# EasyEDA Pro project ProProject_AGV_VH723_MAIN_BOARD_2024-06-24.epro

# Schematic Schematic1
Create Date: 2024-06-01; Page Name: P1; Project Name: AGV_VH723_MAIN_BOARD; Schematic Name: Schematic1; Update Date: 2024-06-02; Company: EasyEDA.com; Drawn: EasyEDA; Page Size: A4; Part Number: JLCPCB-002; Reviewed: EasyEDA; Version: V0.1
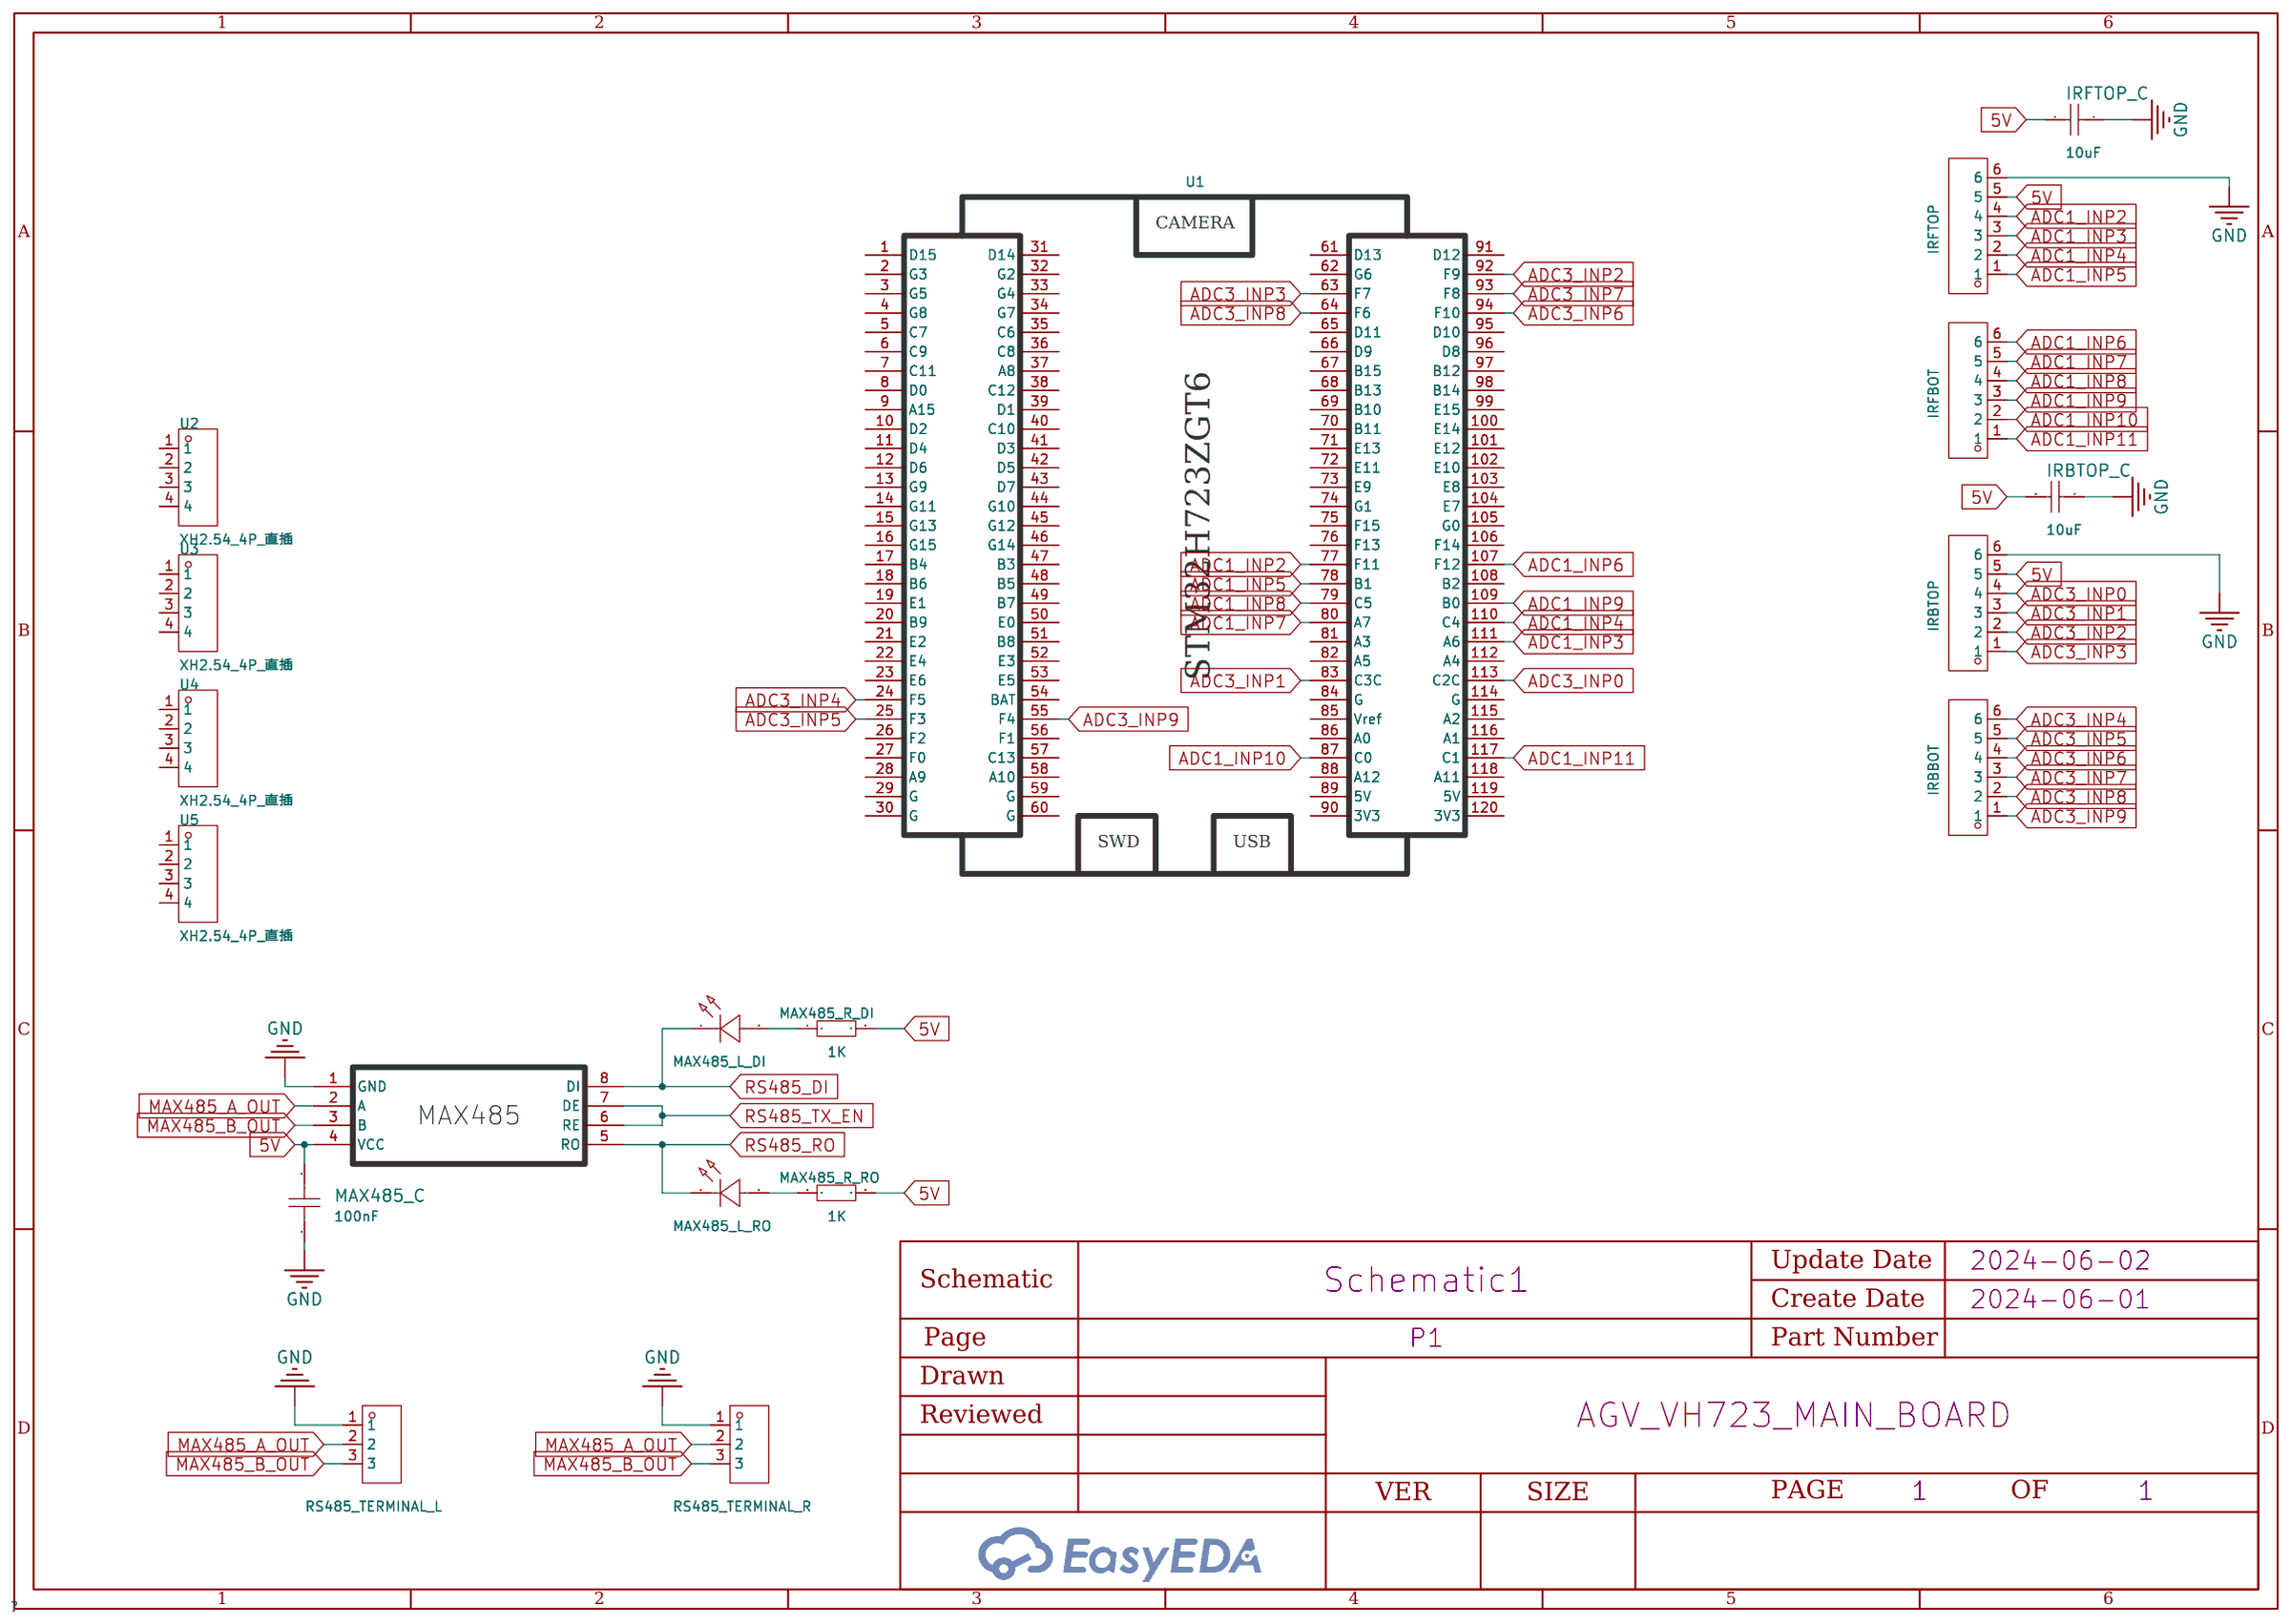
[diagram p0: schematic sheet]

## Parts
IRBBOT  XH2.54*6P_直插  [CONN-TH_XH2.54-6P]
IRBTOP  XH2.54*6P_直插  [CONN-TH_XH2.54-6P]
IRBTOP_C  10uF  [C1206]
IRFBOT  XH2.54*6P_直插  [CONN-TH_XH2.54-6P]
IRFTOP  XH2.54*6P_直插  [CONN-TH_XH2.54-6P]
IRFTOP_C  10uF  [C1206]
MAX485_C  100nF  [C1206]
MAX485_L_DI  LED1206  [LED1206-RD]
MAX485_L_RO  LED1206  [LED1206-RD]
MAX485_R_DI  1K  [R0603]
MAX485_R_RO  1K  [R0603]
RS485_TERMINAL_L  MX128L-5.08-03P-GN01-Cu-Y-A  [CONN-TH_3P-P5.08_MX128L-5.08-03P-GN01-CU-Y-A]
RS485_TERMINAL_R  MX128L-5.08-03P-GN01-Cu-Y-A  [CONN-TH_3P-P5.08_MX128L-5.08-03P-GN01-CU-Y-A]
U1  STM32H723ZGT6  [STM32H723ZGT6 DEV BOARD FOOTPRINT]
U2  XH2.54_4P_直插  [CONN-TH_4P-P2.50-XH2.54-4P]
U3  XH2.54_4P_直插  [CONN-TH_4P-P2.50-XH2.54-4P]
U4  XH2.54_4P_直插  [CONN-TH_4P-P2.50-XH2.54-4P]
U5  XH2.54_4P_直插  [CONN-TH_4P-P2.50-XH2.54-4P]
U6  MAX485 IC RS485 Module  [RS485-arafisrak]

## Library data of the parts
IRBBOT IRBTOP IRFBOT IRFTOP = XH2.54*6P_直插: Supplier Part: C9900008614; Supplier Footprint: XH2.54_6P; Supplier: LCSC
IRBTOP_C IRFTOP_C = CL31A106KOHNNNE: Capacitance: Tolerance:±10% Tolerance:±10% Voltage Rated: Temperature Coefficient:; LCSC Part Name: 10uF ±10% 16V; Supplier Part: C1849; Manufacturer: SAMSUNG(三星); Supplier Footprint: 1206; Datasheet: https://atta.szlcsc.com/upload/public/pdf/source/20160218/1457707763339.pdf; Supplier: LCSC; Tolerance: ±10%
MAX485_C = 1206B104K500CT: Capacitance: Tolerance:±10% Tolerance:±10% Voltage Rated: Temperature Coefficient:; LCSC Part Name: 100nF ±10% 50V; Supplier Part: C93194; Manufacturer: Walsin(华新科); Supplier Footprint: 1206; Datasheet: https://atta.szlcsc.com/upload/public/pdf/source/20181012/C171757_24195D90CC6BA860ED294A8E1EED20EE.pdf; Supplier: LCSC; Tolerance: ±10%
MAX485_L_DI MAX485_L_RO = LED1206: Supplier Part: C9900027223; Supplier: LCSC
MAX485_R_DI MAX485_R_RO = Res_0603: Supplier Footprint: 0603
RS485_TERMINAL_L RS485_TERMINAL_R = MX128L-5.08-03P-GN01-Cu-Y-A: Structure:1x3P Pitch:5.08mm Color:Green Mounting Style:Straight Current Rating (Max):16A Voltage Rating (Max):300V Number of Pins:3P Number of Rows:1 Wire Gauge - AWG:12~28 Wire Gauge - AWG:12~28 Wire Gauge - mm2:2.5 Wire Gauge - mm2:2.5 Number of PINs Pe; LCSC Part Name: 5.08mm 1x3P 排数:1 每排P数:3 直插; Supplier Part: C5188474; Manufacturer: MAX(迈旭); Supplier Footprint: 插件,P=5.08mm; Datasheet: https://atta.szlcsc.com/upload/public/pdf/source/20230914/734DBB306E6087B0D249FDD9D36493EB.pdf; Supplier: LCSC; Structure: 1x3P; Pitch: 5.08mm; Color: Green; Mounting Style: Straight; Current Rating (Max): 16A; Voltage Rating (Max): 300V; Number of Pins: 3P; Number of Rows: 1; Wire Gauge - AWG: 12~28; Wire Gauge - mm2: 2.5; Number of PINs Per Row: 3; Contact Material: Copper Alloy; Contact Plating: Tin; Operating Temperature Range: -40℃~+105℃
U1 = stm32h723zgt6 dev board: STM32H723ZGT6 Core Board and Development Board model made by Araf Israk
U2-U5 = XH2.54_4P_直插: Supplier Part: C9900008616; Supplier Footprint: XH2.54_4P; Supplier: LCSC
U6 = RS485 Module

## Nets
5V: IRBTOP.5 IRBTOP_C.2 IRFTOP.5 IRFTOP_C.2 MAX485_C.2 MAX485_R_DI.2 MAX485_R_RO.2 U6.4(VCC)
GND: IRBTOP.6 IRBTOP_C.1 IRFTOP.6 IRFTOP_C.1 MAX485_C.1 RS485_TERMINAL_L.1 RS485_TERMINAL_R.1 U6.1(GND)
ADC1_INP2: IRFTOP.4 U1.77(F11)
ADC1_INP3: IRFTOP.3 U1.111(A6)
ADC1_INP4: IRFTOP.2 U1.110(C4)
ADC1_INP5: IRFTOP.1 U1.78(B1)
ADC1_INP6: IRFBOT.6 U1.107(F12)
ADC1_INP7: IRFBOT.5 U1.80(A7)
ADC1_INP8: IRFBOT.4 U1.79(C5)
ADC1_INP9: IRFBOT.3 U1.109(B0)
ADC1_INP10: IRFBOT.2 U1.87(C0)
ADC1_INP11: IRFBOT.1 U1.117(C1)
ADC3_INP0: IRBTOP.4 U1.113(C2C)
ADC3_INP1: IRBTOP.3 U1.83(C3C)
ADC3_INP2: IRBTOP.2 U1.92(F9)
ADC3_INP3: IRBTOP.1 U1.63(F7)
ADC3_INP4: IRBBOT.6 U1.24(F5)
ADC3_INP5: IRBBOT.5 U1.25(F3)
ADC3_INP6: IRBBOT.4 U1.94(F10)
ADC3_INP7: IRBBOT.3 U1.93(F8)
ADC3_INP8: IRBBOT.2 U1.64(F6)
ADC3_INP9: IRBBOT.1 U1.55(F4)
MAX485_A_OUT: RS485_TERMINAL_L.2 RS485_TERMINAL_R.2 U6.2(A)
MAX485_B_OUT: RS485_TERMINAL_L.3 RS485_TERMINAL_R.3 U6.3(B)
RS485_DI: MAX485_L_DI.1(K) U6.8(DI)
RS485_RO: MAX485_L_RO.1(K) U6.5(RO)
RS485_TX_EN: U6.6(RE) U6.7(DE)
$1N2419: MAX485_L_RO.2(A) MAX485_R_RO.1
$1N2431: MAX485_L_DI.2(A) MAX485_R_DI.1

Not connected (* = marked no-connect by the designer): U1 1(D15) 2(G3) 3(G5) 4(G8) 5(C7) 6(C9) 7(C11) 8(D0) 9(A15) 10(D2) 11(D4) 12(D6) 13(G9) 14(G11) 15(G13) 16(G15) 17(B4) 18(B6) 19(E1) 20(B9) 21(E2) 22(E4) 23(E6) 26(F2) 27(F0) 28(A9) 29(G) 30(G) 31(D14) 32(G2) 33(G4) 34(G7) 35(C6) 36(C8) 37(A8) 38(C12) 39(D1) 40(C10) 41(D3) 42(D5) 43(D7) 44(G10) 45(G12) 46(G14) 47(B3) 48(B5) 49(B7) 50(E0) 51(B8) 52(E3) 53(E5) 54(BAT) 56(F1) 57(C13) 58(A10) 59(G) 60(G) 61(D13) 62(G6) 65(D11) 66(D9) 67(B15) 68(B13) 69(B10) 70(B11) 71(E13) 72(E11) 73(E9) 74(G1) 75(F15) 76(F13) 81(A3) 82(A5) 84(G) 85(Vref) 86(A0) 88(A12) 89(5V) 90(3V3) 91(D12) 95(D10) 96(D8) 97(B12) 98(B14) 99(E15) 100(E14) 101(E12) 102(E10) 103(E8) 104(E7) 105(G0) 106(F14) 108(B2) 112(A4) 114(G) 115(A2) 116(A1) 118(A11) 119(5V) 120(3V3); U2 1 2 3 4; U3 1 2 3 4; U4 1 2 3 4; U5 1 2 3 4

# Board PCB1
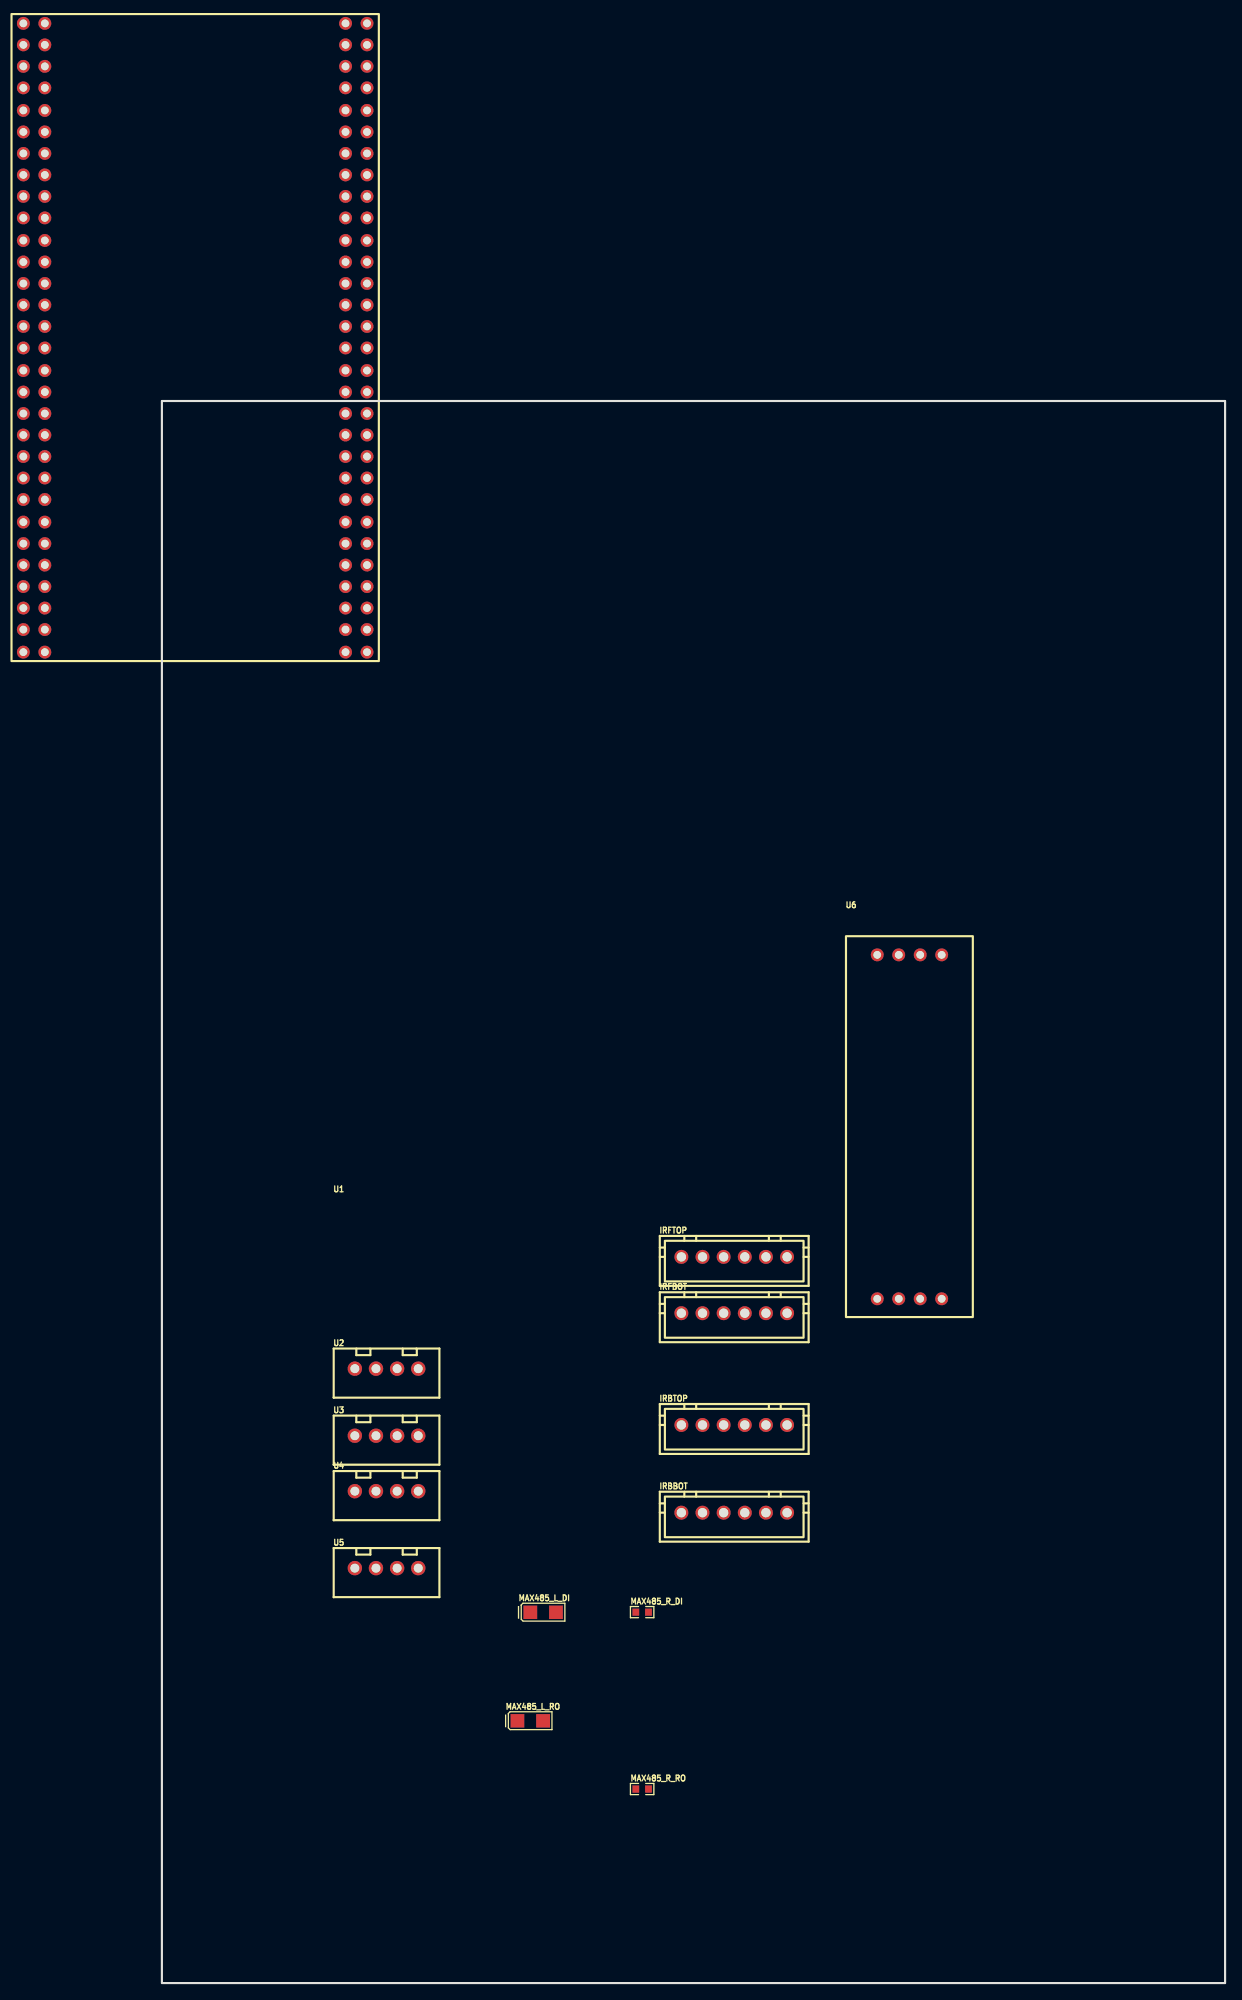
[diagram p1: board, top side]
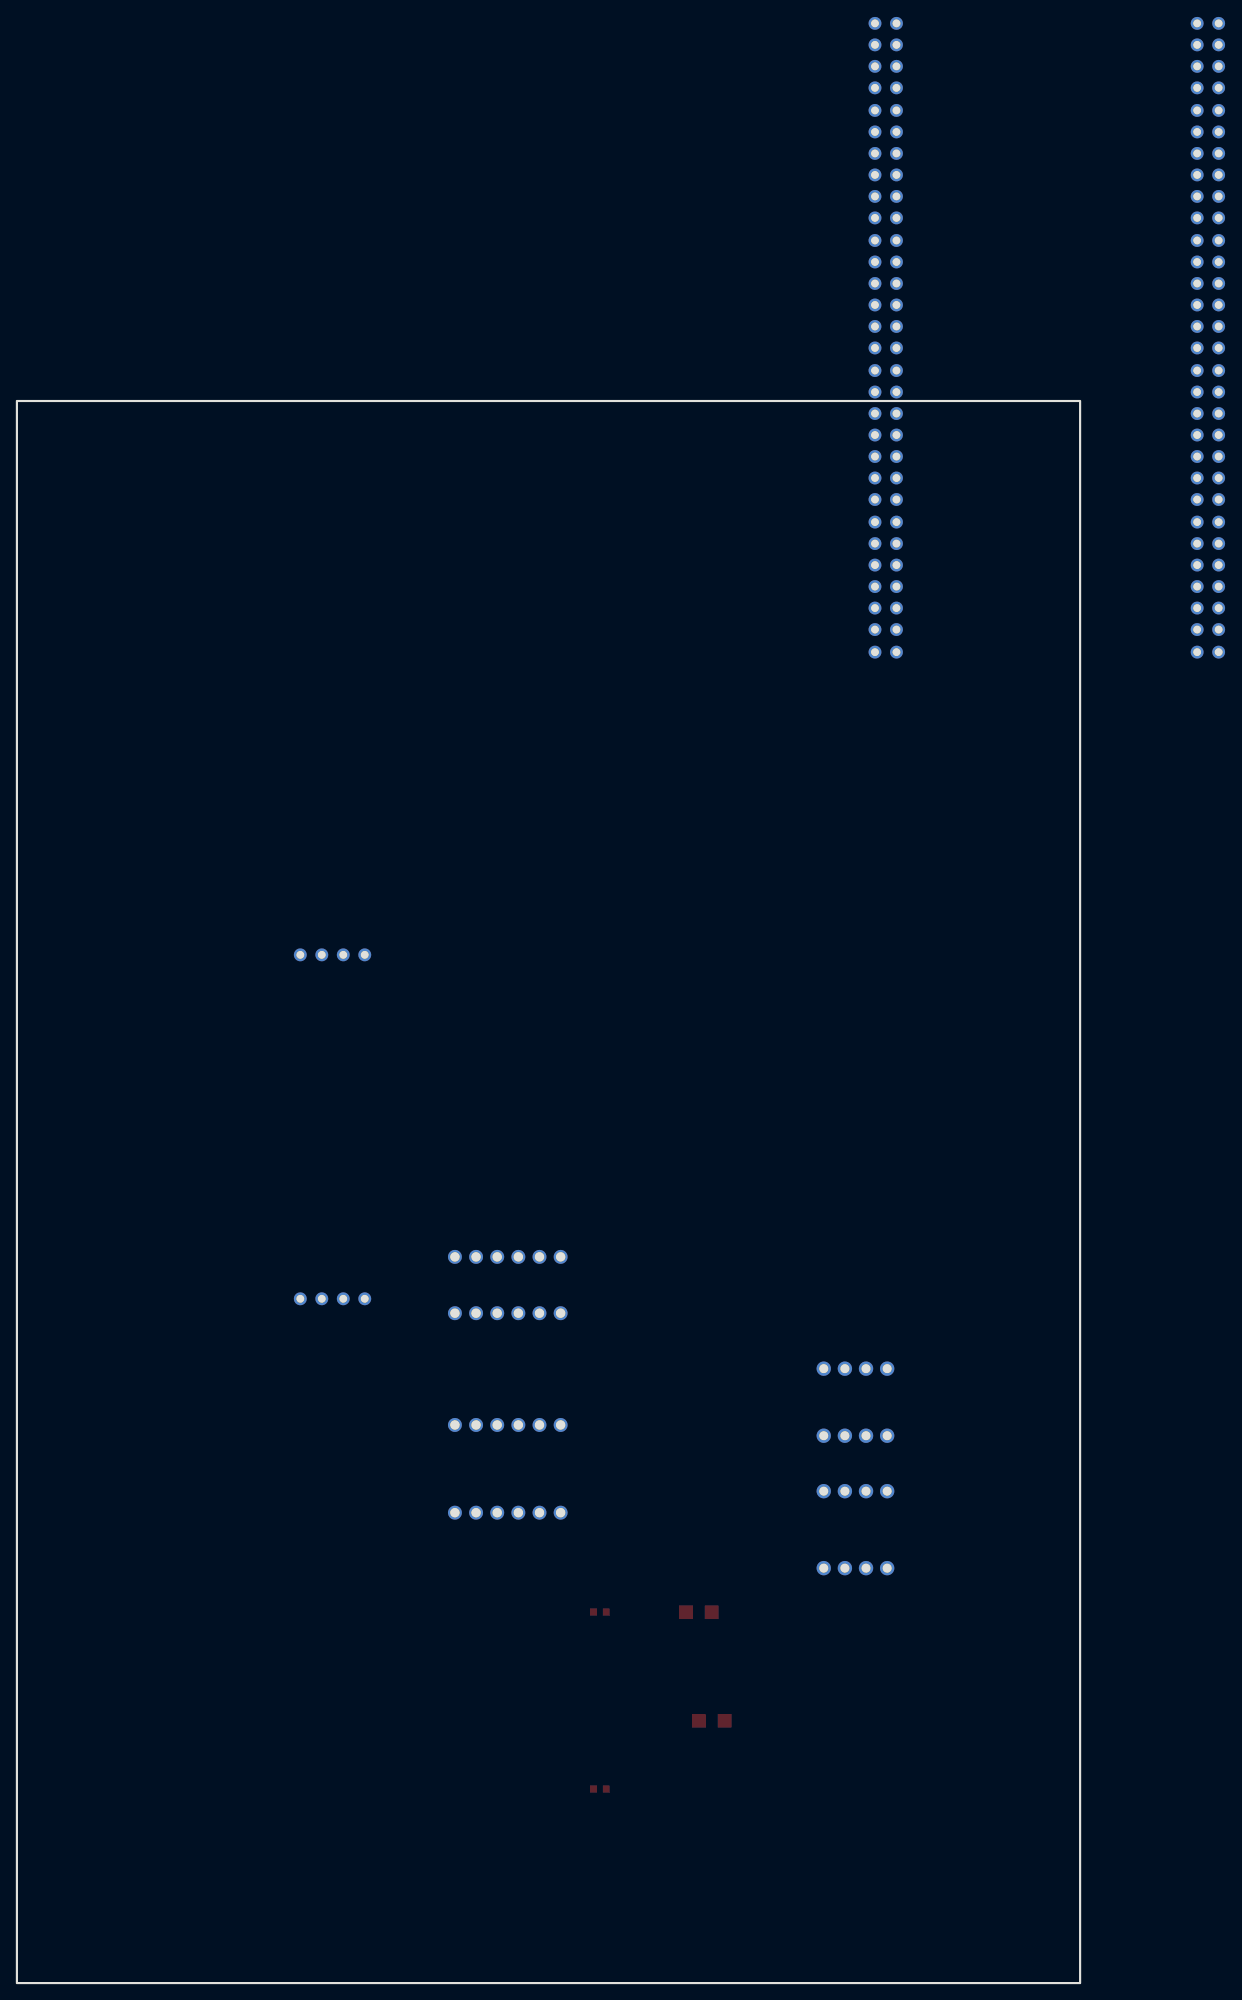
[diagram p2: board, bottom side, seen from below]

Outline 125.73 x 186.94 mm; copper layers: Top Layer, Bottom Layer. Coordinates in mm from the lower left corner of the outline.
Outline path: rectangle 0,186.94 125.73,0
Stack: Top Layer 0.035mm / Dielectric1 1.51mm FR4 er 4.5 / Bottom Layer 0.035mm

## Design rules (mm)
template: JLCPCB Capability(Two Layers Board)
spacing copperThickness1oz (default): track to track 0.102, other pairs 0.152 to 0.3
spacing copperThickness2oz: track to track 0.203, other pairs 0.152 to 0.3
track width copperThickness1oz (default): min 0.127, default 0.254, max 2.54
track width copperThickness2oz: min 0.203, default 0.254, max 2.54
differential pair differentialPair (default): width min 0.127, default 0.254, max 2.54; gap min 0.152, default 0.152
via viaSize (default): diameter min 0.5, default 0.61, max 10; hole min 0.3, default 0.305, max 6.3

## Placement (name value [footprint] x y rotation side)
IRBBOT  XH2.54*6P_直插  [CONN-TH_XH2.54-6P]  67.68 55.58 0 top
IRBTOP  XH2.54*6P_直插  [CONN-TH_XH2.54-6P]  67.68 65.95 0 top
IRFBOT  XH2.54*6P_直插  [CONN-TH_XH2.54-6P]  67.68 79.15 0 top
IRFTOP  XH2.54*6P_直插  [CONN-TH_XH2.54-6P]  67.68 85.81 0 top
MAX485_L_DI  LED1206  [LED1206-RD]  45.09 43.81 0 top
MAX485_L_RO  LED1206  [LED1206-RD]  43.56 30.99 0 top
MAX485_R_DI  1K  [R0603]  56.79 43.83 0 top
MAX485_R_RO  1K  [R0603]  56.79 22.93 0 top
U1  STM32H723ZGT6  [STM32H723ZGT6 DEV BOARD FOOTPRINT]  21.72 170.73 0 top
U2  XH2.54_4P_直插  [CONN-TH_4P-P2.50-XH2.54-4P]  26.57 72.6 0 top
U3  XH2.54_4P_直插  [CONN-TH_4P-P2.50-XH2.54-4P]  26.57 64.68 0 top
U4  XH2.54_4P_直插  [CONN-TH_4P-P2.50-XH2.54-4P]  26.57 58.12 0 top
U5  XH2.54_4P_直插  [CONN-TH_4P-P2.50-XH2.54-4P]  26.57 49.03 0 top
U6  MAX485 IC RS485 Module  [RS485-arafisrak]  85.22 121.16 0 top

## Footprints (pads in the part's own frame, mm; a bottom-side part is the same pattern mirrored in y, then rotated)
CONN-TH_4P-P2.50-XH2.54-4P
  round 1.7 hole 1.05: 1(3.75,0) 2(1.25,0) 3(-1.25,0) 4(-3.75,0)
CONN-TH_XH2.54-6P
  round 1.65 hole 1.1: 1(-6.25,0) 2(-3.75,0) 3(-1.25,0) 4(1.25,0) 5(3.75,0) 6(6.25,0)
LED1206-RD
  rect 1.635x1.6 smd: 1(-1.518,0) 2(1.518,0)
R0603
  rect 0.806x0.864 smd: 1(-0.753,0) 2(0.753,0)
RS485-arafisrak
  round 1.524 hole 0.914: 1(-0.621,-40.301) 2(1.919,-40.301) 3(4.459,-40.301) 4(6.999,-40.301) 5(6.999,0.339) 6(4.459,0.339) 7(1.919,0.339) 8(-0.621,0.339)
STM32H723ZGT6 DEV BOARD FOOTPRINT
  round 1.524 hole 0.914: 1(-38.1,60.833) 2(-38.1,58.293) 3(-38.1,55.753) 4(-38.1,53.213) 5(-38.1,50.546) 6(-38.1,48.006) 7(-38.1,45.466) 8(-38.1,42.926) 9(-38.1,40.386) 10(-38.1,37.846) 11(-38.1,35.179) 12(-38.1,32.639) 13(-38.1,30.099) 14(-38.1,27.559) 15(-38.1,25.019) 16(-38.1,22.479) 17(-38.1,19.812) 18(-38.1,17.272) 19(-38.1,14.732) 20(-38.1,12.192) 21(-38.1,9.652) 22(-38.1,7.112) 23(-38.1,4.572) 24(-38.1,1.905) 25(-38.1,-0.635) 26(-38.1,-3.175) 27(-38.1,-5.715) 28(-38.1,-8.255) 29(-38.1,-10.795) 30(-38.1,-13.462) 31(-35.56,60.833) 32(-35.56,58.293) 33(-35.56,55.753) 34(-35.56,53.213) 35(-35.56,50.546) 36(-35.56,48.006) 37(-35.56,45.466) 38(-35.56,42.926) 39(-35.56,40.386) 40(-35.56,37.846) 41(-35.56,35.179) 42(-35.56,32.639) 43(-35.56,30.099) 44(-35.56,27.559) 45(-35.56,25.019) 46(-35.56,22.479) 47(-35.56,19.812) 48(-35.56,17.272) 49(-35.56,14.732) 50(-35.56,12.192) 51(-35.56,9.652) 52(-35.56,7.112) 53(-35.56,4.572) 54(-35.56,1.905) 55(-35.56,-0.635) 56(-35.56,-3.175) 57(-35.56,-5.715) 58(-35.56,-8.255) 59(-35.56,-10.795) 60(-35.56,-13.462) 61(0,60.833) 62(0,58.293) 63(0,55.753) 64(0,53.213) 65(0,50.546) 66(0,48.006) 67(0,45.466) 68(0,42.926) 69(0,40.386) 70(0,37.846) 71(0,35.179) 72(0,32.639) 73(0,30.099) 74(0,27.559) 75(0,25.019) 76(0,22.479) 77(0,19.812) 78(0,17.272) 79(0,14.732) 80(0,12.192) 81(0,9.652) 82(0,7.112) 83(0,4.572) 84(0,1.905) 85(0,-0.635) 86(0,-3.175) 87(0,-5.715) 88(0,-8.255) 89(0,-10.795) 90(0,-13.462) 91(2.54,60.833) 92(2.54,58.293) 93(2.54,55.753) 94(2.54,53.213) 95(2.54,50.546) 96(2.54,48.006) 97(2.54,45.466) 98(2.54,42.926) 99(2.54,40.386) 100(2.54,37.846) 101(2.54,35.179) 102(2.54,32.639) 103(2.54,30.099) 104(2.54,27.559) 105(2.54,25.019) 106(2.54,22.479) 107(2.54,19.812) 108(2.54,17.272) 109(2.54,14.732) 110(2.54,12.192) 111(2.54,9.652) 112(2.54,7.112) 113(2.54,4.572) 114(2.54,1.905) 115(2.54,-0.635) 116(2.54,-3.175) 117(2.54,-5.715) 118(2.54,-8.255) 119(2.54,-10.795) 120(2.54,-13.462)

## Nets
5V: IRBTOP.5 IRFTOP.5 MAX485_R_DI.2 MAX485_R_RO.2
GND: IRBTOP.6 IRFTOP.6
$1N2409: MAX485_L_RO.1 U6.5
$1N2419: MAX485_L_RO.2 MAX485_R_RO.1
$1N2426: MAX485_L_DI.1 U6.8
$1N2431: MAX485_L_DI.2 MAX485_R_DI.1

Pads without a net: IRBBOT 1 2 3 4 5 6; IRBTOP 1 2 3 4; IRFBOT 1 2 3 4 5 6; IRFTOP 1 2 3 4; U1 1 2 3 4 5 6 7 8 9 10 11 12 13 14 15 16 17 18 19 20 21 22 23 24 25 26 27 28 29 30 31 32 33 34 35 36 37 38 39 40 41 42 43 44 45 46 47 48 49 50 51 52 53 54 55 56 57 58 59 60 61 62 63 64 65 66 67 68 69 70 71 72 73 74 75 76 77 78 79 80 81 82 83 84 85 86 87 88 89 90 91 92 93 94 95 96 97 98 99 100 101 102 103 104 105 106 107 108 109 110 111 112 113 114 115 116 117 118 119 120; U2 1 2 3 4; U3 1 2 3 4; U4 1 2 3 4; U5 1 2 3 4; U6 1 2 3 4 6 7
